# EAGLE schematic BlazeIt (EAGLE 8.2.2)
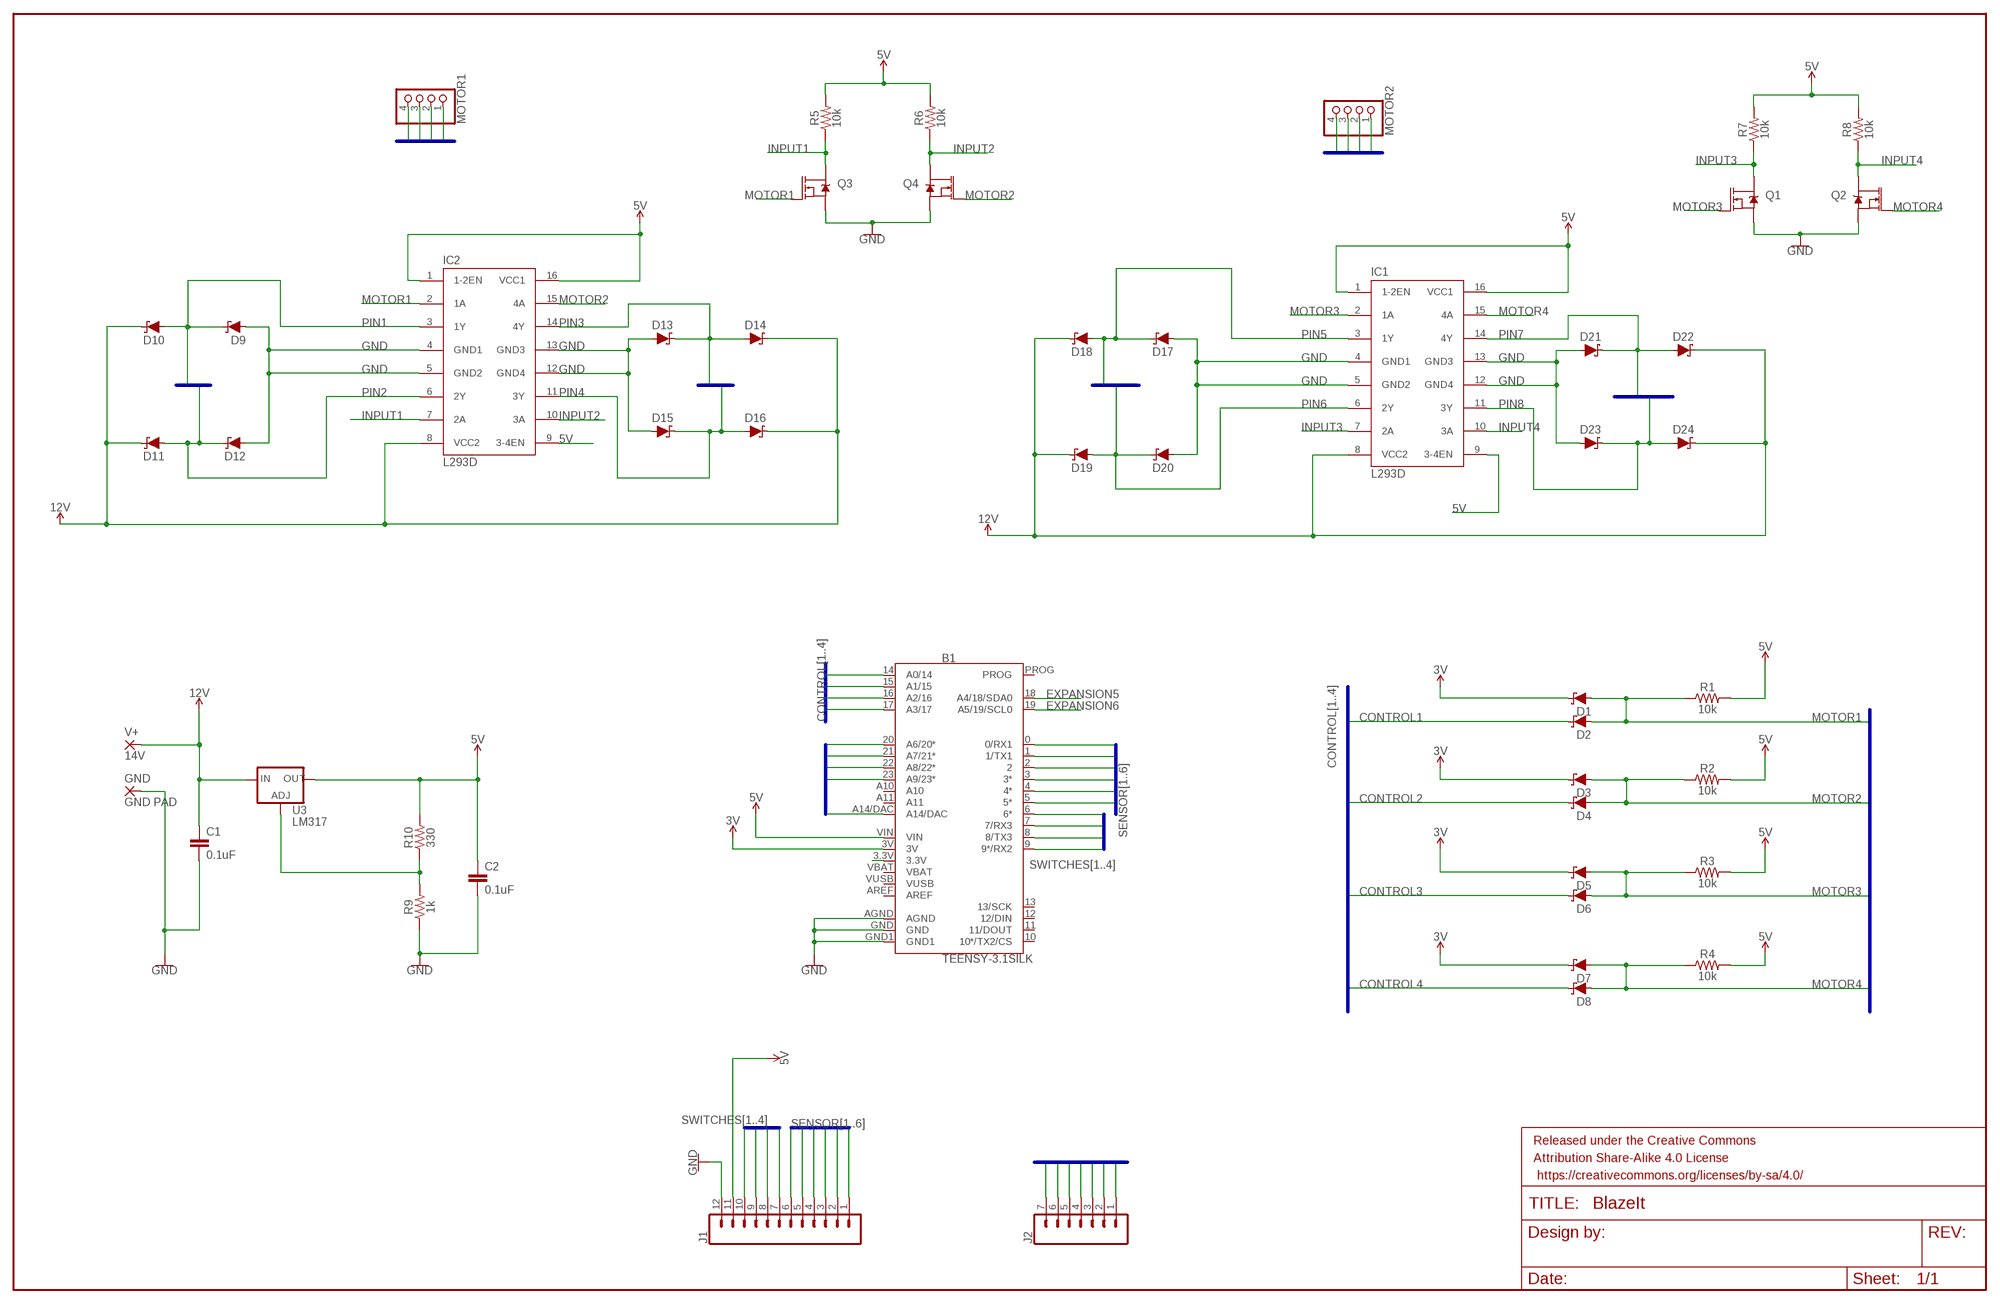
[diagram p0: schematic, sheet 1]

## Parts
B1  TEENSY-3.1SILK  [TEENSY-3.1]
C1  0.1uF  0.1UF-0603-25V-5%  [0603]
C2  0.1uF  0.1UF-0603-25V-5%  [0603]
D1  DIODE-SCHOTTKY-PMEG4005EJ  [SOD-323]
D2  DIODE-SCHOTTKY-PMEG4005EJ  [SOD-323]
D3  DIODE-SCHOTTKY-PMEG4005EJ  [SOD-323]
D4  DIODE-SCHOTTKY-PMEG4005EJ  [SOD-323]
D5  DIODE-SCHOTTKY-PMEG4005EJ  [SOD-323]
D6  DIODE-SCHOTTKY-PMEG4005EJ  [SOD-323]
D7  DIODE-SCHOTTKY-PMEG4005EJ  [SOD-323]
D8  DIODE-SCHOTTKY-PMEG4005EJ  [SOD-323]
D9  DIODE-SCHOTTKY-PMEG4005EJ  [SOD-323]
D10  DIODE-SCHOTTKY-PMEG4005EJ  [SOD-323]
D11  DIODE-SCHOTTKY-PMEG4005EJ  [SOD-323]
D12  DIODE-SCHOTTKY-PMEG4005EJ  [SOD-323]
D13  DIODE-SCHOTTKY-PMEG4005EJ  [SOD-323]
D14  DIODE-SCHOTTKY-PMEG4005EJ  [SOD-323]
D15  DIODE-SCHOTTKY-PMEG4005EJ  [SOD-323]
D16  DIODE-SCHOTTKY-PMEG4005EJ  [SOD-323]
D17  DIODE-SCHOTTKY-PMEG4005EJ  [SOD-323]
D18  DIODE-SCHOTTKY-PMEG4005EJ  [SOD-323]
D19  DIODE-SCHOTTKY-PMEG4005EJ  [SOD-323]
D20  DIODE-SCHOTTKY-PMEG4005EJ  [SOD-323]
D21  DIODE-SCHOTTKY-PMEG4005EJ  [SOD-323]
D22  DIODE-SCHOTTKY-PMEG4005EJ  [SOD-323]
D23  DIODE-SCHOTTKY-PMEG4005EJ  [SOD-323]
D24  DIODE-SCHOTTKY-PMEG4005EJ  [SOD-323]
FRAME1  FRAME-LEDGER  [CREATIVE_COMMONS]
GND  GND PAD  WIREPADSMD2,54-5,08  [SMD2,54-5,08]
IC1  L293D  [DIL16]
IC2  L293D  [DIL16]
J1  CONN_12  [1X12]
J2  CONN_07LOCK  [1X07_LOCK]
MOTOR1  PINHD-1X4  [1X04]
MOTOR2  PINHD-1X4  [1X04]
Q1  MOSFET-NCH-2N7002PW  [SOT323]
Q2  MOSFET-NCH-2N7002PW  [SOT323]
Q3  MOSFET-NCH-2N7002PW  [SOT323]
Q4  MOSFET-NCH-2N7002PW  [SOT323]
R1  10k  10KOHM-0603-1/10W-1%  [0603]
R2  10k  10KOHM-0603-1/10W-1%  [0603]
R3  10k  10KOHM-0603-1/10W-1%  [0603]
R4  10k  10KOHM-0603-1/10W-1%  [0603]
R5  10k  10KOHM-0603-1/10W-1%  [0603]
R6  10k  10KOHM-0603-1/10W-1%  [0603]
R7  10k  10KOHM-0603-1/10W-1%  [0603]
R8  10k  10KOHM-0603-1/10W-1%  [0603]
R9  1k  1KOHM-0603-1/10W-1%  [0603]
R10  330  3.3KOHM-0603-1/10W-1%  [0603]
U3  LM317  V_REG_317SINK  [TO220-ADJ]
V+  14V  WIREPADSMD2,54-5,08  [SMD2,54-5,08]

## Nets
3.3V: B1.3V D1.C D3.C D5.C D7.C ; supply symbol labelled 3V
5V: B1.VIN C2.1 IC1.1(1-2EN) IC1.9(3-4EN) IC1.16(VCC1) IC2.1(1-2EN) IC2.9(3-4EN) IC2.16(VCC1) J1.11 R1.2 R2.2 R3.2 R4.2 R5.2 R6.2 R7.2 R8.2 R10.2 U3.OUT
12V: C1.1 D10.C D11.C D14.C D16.C D18.C D19.C D22.C D24.C IC1.8(VCC2) IC2.8(VCC2) U3.IN V+.1(P)
CONTROL1: B1.17(A3/17) D2.C
CONTROL2: B1.16(A2/16) D4.C
CONTROL3: B1.15(A1/15) D6.C
CONTROL4: B1.14(A0/14) D8.C
EXPANSION1: B1.20(A6/20*) J2.1
EXPANSION2: B1.21(A7/21*) J2.2
EXPANSION3: B1.22(A8/22*) J2.3
EXPANSION4: B1.23(A9/23*) J2.4
EXPANSION5: B1.18(A4/18/SDA0) J2.5
EXPANSION6: B1.19(A5/19/SCL0) J2.6
EXPANSION7: B1.A14/DAC J2.7
GND: B1.AGND B1.GND B1.GND1 C1.2 C2.2 D9.A D12.A D13.A D15.A D17.A D20.A D21.A D23.A GND.1(P) IC1.4(GND1) IC1.5(GND2) IC1.12(GND4) IC1.13(GND3) IC2.4(GND1) IC2.5(GND2) IC2.12(GND4) IC2.13(GND3) J1.12 Q1.2(S) Q2.2(S) Q3.2(S) Q4.2(S) R9.1
INPUT1: IC2.7(2A) Q3.3(D) R5.1
INPUT2: IC2.10(3A) Q4.3(D) R6.1
INPUT3: IC1.7(2A) Q1.3(D) R7.1
INPUT4: IC1.10(3A) Q2.3(D) R8.1
MOTOR1: D1.A D2.A IC2.2(1A) Q3.1(G) R1.1
MOTOR2: D3.A D4.A IC2.15(4A) Q4.1(G) R2.1
MOTOR3: D5.A D6.A IC1.2(1A) Q1.1(G) R3.1
MOTOR4: D7.A D8.A IC1.15(4A) Q2.1(G) R4.1
N$1: B1.3.3V
N$6: R9.2 R10.1 U3.ADJ
PIN1: D9.C D10.A IC2.3(1Y) MOTOR1.4
PIN2: D11.A D12.C IC2.6(2Y) MOTOR1.3
PIN3: D13.C D14.A IC2.14(4Y) MOTOR1.2
PIN4: D15.C D16.A IC2.11(3Y) MOTOR1.1
PIN5: D17.C D18.A IC1.3(1Y) MOTOR2.4
PIN6: D19.A D20.C IC1.6(2Y) MOTOR2.3
PIN7: D21.C D22.A IC1.14(4Y) MOTOR2.2
PIN8: D23.C D24.A IC1.11(3Y) MOTOR2.1
SENSOR1: B1.0(0/RX1) J1.1
SENSOR2: B1.1(1/TX1) J1.2
SENSOR3: B1.2 J1.3
SENSOR4: B1.3(3*) J1.4
SENSOR5: B1.4(4*) J1.5
SENSOR6: B1.5(5*) J1.6
SWITCHES1: B1.6(6*) J1.7
SWITCHES2: B1.7(7/RX3) J1.8
SWITCHES3: B1.8(8/TX3) J1.9
SWITCHES4: B1.9(9*/RX2) J1.10
Unconnected: B1.10(10*/TX2/CS) B1.11(11/DOUT) B1.12(12/DIN) B1.13(13/SCK) B1.A10 B1.A11 B1.AREF B1.PROG

## Buses
CONTROL[1..4]
SENSOR[1..6]
MOTOR[1..4]
SWITCHES[1..4]
PIN[1..2]
PIN[1..4]
PIN[3..4]
PIN[5..8]
PIN[5..6]
PIN[7..8]
EXPANSION[1..7]

## Power pins joined to a net without a drawn wire
VBAT: B1.VBAT
VUSB: B1.VUSB

## Library data of the parts
B1 = SparkFun-Boards:TEENSY-3.1: Teensy 3+ Footprint Mechanical footprint with connectors for Teensy Development Board with ARM Cortex. SparkFun Products: Teensy 3.2 <https://www.sparkfun.com/products/13736> Teensy LC <https://www.sparkfun.com/products/13305>; SF_ID: DEV-12646
C1 C2 = SparkFun-Capacitors:0.1UF: 0.1µF ceramic capacitors A capacitor is a passive two-terminal electrical component used to store electrical energy temporarily in an electric field.; PROD_ID: CAP-08604
D1-D24 = SparkFun-DiscreteSemi:DIODE-SCHOTTKY: Schottky diode A Schottky diode is a semiconductor diode which has a low forward voltage drop and a very fast switching action.; PROD_ID: DIO-10955; VALUE: 0.5A/40V/420mV
FRAME1 = SparkFun-Aesthetics:FRAME-LEDGER: Schematic Frame - Ledger Standard 11x14 US Ledger frame
GND V+ = wirepad:WIREPAD: Wire PAD connect wire on PCB
IC1 IC2 = st-microelectronics:L293D: PUSH-PULL 4 CHANNEL DRIVER; MPN: L293D; OC_FARNELL: 9589619; OC_NEWARK: 56P8249
J1 = SparkFun-Connectors:CONN_12: Multi connection point. Often used as Generic Header-pin footprint for 0.1 inch spaced/style header connections On any of the 0.1 inch spaced packages, you can populate with these: Break Away Headers - Straight <https://www.sparkfun.com/products/116> (PRT-00116) Break Away Male Headers - Right Angle <https://www.sparkfun.com/products/553> (PRT-00553) Female Headers <https://www.sparkfun.com/products/115> (PRT-00115) Break Away Headers - Machine Pin <https://www.sparkfun.com/products/117> (PRT-00117) Break Away Female Headers - Swiss Machine Pin <https://www.sparkfun.com/products/743> (PRT-00743) For SCREWTERMINALS and SPRING TERMINALS visit here: Screw Terimnals on SparkFun.com <https://www.sparkfun.com/search/results?term=Screw+Terminals> (5mm/3.5mm/2.54mm spacing) This device is also useful as a general connection point to wire up your design to another part of your project. Our various solder wires solder well into these plated through hole pads. Hook-Up Wire - Assortment (Stranded, 22 AWG) <https://www.sparkfun.com/products/11375> (PRT-11375) Hook-Up Wire - Assortment (Solid Core, 22 AWG) <https://www.sparkfun.com/products/11367> (PRT-11367) View the entire wire category on our website here <https://www.sparkfun.com/categories/141> Special notes: Molex polarized connector foot print use with SKU : PRT-08231 with associated crimp pins and housings. 1MM SMD Version SKU: PRT-10208 NOTES ON THE VARIANTS LOCK and LOCK_LONGPADS... This footprint was designed to help hold the alignment of a through-hole component (i.e. 6-pin header) while soldering it into place. You may notice that each hole has been shifted either up or down by 0.005 of an inch from it's more standard position (which is a perfectly straight line). This slight alteration caused the pins (the squares in the middle) to touch the edges of the holes. Because they are alternating, it causes a "brace" to hold the component in place. 0.005 has proven to be the perfect amount of "off-center" position when using our standard breakaway headers. Although looks a little odd when you look at the bare footprint, once you have a header in there, the alteration is very hard to notice. Also,if you push a header all the way into place, it is covered up entirely on the bottom side.
J2 = SparkFun-Connectors:CONN_07: Multi connection point. Often used as Generic Header-pin footprint for 0.1 inch spaced/style header connections On any of the 0.1 inch spaced packages, you can populate with these: Break Away Headers - Straight <https://www.sparkfun.com/products/116> (PRT-00116) Break Away Male Headers - Right Angle <https://www.sparkfun.com/products/553> (PRT-00553) Female Headers <https://www.sparkfun.com/products/115> (PRT-00115) Break Away Headers - Machine Pin <https://www.sparkfun.com/products/117> (PRT-00117) Break Away Female Headers - Swiss Machine Pin <https://www.sparkfun.com/products/743> (PRT-00743) For SCREWTERMINALS and SPRING TERMINALS visit here: Screw Terimnals on SparkFun.com <https://www.sparkfun.com/search/results?term=Screw+Terminals> (5mm/3.5mm/2.54mm spacing) This device is also useful as a general connection point to wire up your design to another part of your project. Our various solder wires solder well into these plated through hole pads. Hook-Up Wire - Assortment (Stranded, 22 AWG) <https://www.sparkfun.com/products/11375> (PRT-11375) Hook-Up Wire - Assortment (Solid Core, 22 AWG) <https://www.sparkfun.com/products/11367> (PRT-11367) View the entire wire category on our website here <https://www.sparkfun.com/categories/141> Special notes: Molex polarized connector foot print use with SKU : PRT-08231 with associated crimp pins and housings. 1MM SMD Version SKU: PRT-10208 NOTES ON THE VARIANTS LOCK and LOCK_LONGPADS... This footprint was designed to help hold the alignment of a through-hole component (i.e. 6-pin header) while soldering it into place. You may notice that each hole has been shifted either up or down by 0.005 of an inch from it's more standard position (which is a perfectly straight line). This slight alteration caused the pins (the squares in the middle) to touch the edges of the holes. Because they are alternating, it causes a "brace" to hold the component in place. 0.005 has proven to be the perfect amount of "off-center" position when using our standard breakaway headers. Although looks a little odd when you look at the bare footprint, once you have a header in there, the alteration is very hard to notice. Also,if you push a header all the way into place, it is covered up entirely on the bottom side.
MOTOR1 MOTOR2 = pinhead:PINHD-1X4: PIN HEADER
Q1-Q4 = SparkFun-DiscreteSemi:MOSFET-NCH: N-channel MOSFETs Voltage controlled devices that allow control of high current outputs. SparkFun Products: SparkFun OpenScale <https://www.sparkfun.com/products/13261> SparkFun Digital Sandbox <https://www.sparkfun.com/products/12651> SparkFun Monster Moto Shield <https://www.sparkfun.com/products/10182> SparkFun MOSFET Power Controller <https://www.sparkfun.com/products/11214>; PROD_ID: TRANS-11151; VALUE: 310mA/60V/1.6Ω
R1-R8 = SparkFun-Resistors:10KOHM: 10kΩ resistor A resistor is a passive two-terminal electrical component that implements electrical resistance as a circuit element. Resistors act to reduce current flow, and, at the same time, act to lower voltage levels within circuits. - Wikipedia; PROD_ID: RES-00824
R9 = SparkFun-Resistors:1KOHM: 1kΩ resistor A resistor is a passive two-terminal electrical component that implements electrical resistance as a circuit element. Resistors act to reduce current flow, and, at the same time, act to lower voltage levels within circuits. - Wikipedia; PROD_ID: RES-07856
R10 = SparkFun-Resistors:3.3KOHM: 3.3kΩ resistor A resistor is a passive two-terminal electrical component that implements electrical resistance as a circuit element. Resistors act to reduce current flow, and, at the same time, act to lower voltage levels within circuits. - Wikipedia; PROD_ID: RES-07851; VALUE: 3.3k
U3 = SparkFun-IC-Power:V_REG_317: Voltage Regulator Standard LM317 adjustable voltage regulator. AOI (Adjust Output Input). Google 'LM317 Calculator' for easy to use app to get the two resistor values needed. 240/720 for 5V output. 240/390 for 3.3V output. Spark Fun Electronics SKU : COM-00527